# Altium schematic sheet STM32_microcontroller.SchDoc
size A4; SheetNumber: 2; SheetTotal: 7
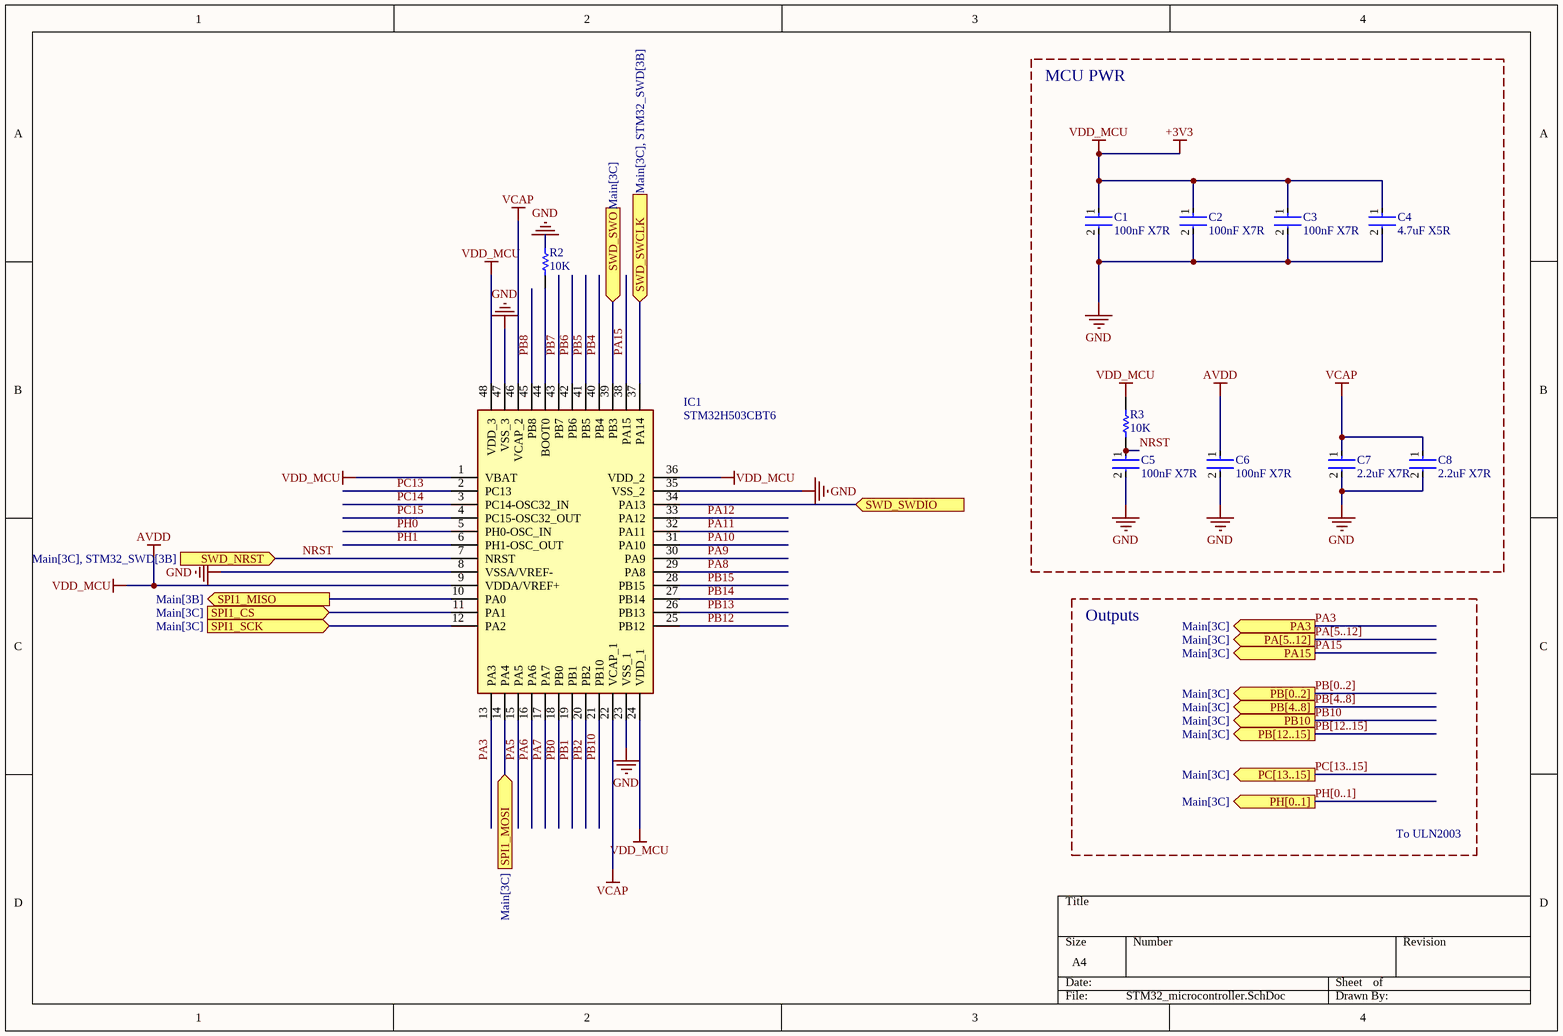
[diagram p0: STM32_microcontroller.SchDoc]

## Parts
C1  100nF X7R  [FP-CL10-IPC_C]
C2  100nF X7R  [FP-CL10-IPC_C]
C3  100nF X7R  [FP-CL10-IPC_C]
C4  4.7uF X5R  [FP-CL21-IPC_B]
C5  100nF X7R  [FP-CL10-IPC_C]
C6  100nF X7R  [FP-CL10-IPC_C]
C7  2.2uF X7R  [FP-CC0805-0_85-MFG]
C8  2.2uF X7R  [FP-CC0805-0_85-MFG]
IC1  STM32H503CBT6  [QFP50P900X900X160-48N]
R2  10K  [RESC1609X50X30ML10T20]
R3  10K  [RESC1609X50X30ML10T20]

## Blocks framed on the sheet
MCU PWR: C1-C8 R3

## Ports
PA3 (out, see Main[3C]), PA15 (out, see Main[3C]), PA[5..12] (out, see Main[3C]), PB10 (out, see Main[3C]), PB[0..2] (out, see Main[3C]), PB[4..8] (out, see Main[3C]), PB[12..15] (out, see Main[3C]), PC[13..15] (out, see Main[3C]), PH[0..1] (out, see Main[3C]), SPI1_CS (in, see Main[3C]), SPI1_MISO (out, see Main[3B]), SPI1_MOSI (in, see Main[3C]), SPI1_SCK (in, see Main[3C]), SWD_NRST (in, see Main[3C], STM32_SWD[3B]), SWD_SWCLK (in, see Main[3C], STM32_SWD[3B]), SWD_SWDIO (in, see Main[3C], STM32_SWD[3B]), SWD_SWO (in, see Main[3C])

## Nets
+3V3: C1.1 C2.1 C3.1 C4.1 C6.1 IC1.1(VBAT) IC1.9(VDDA/VREF+) IC1.24(VDD_1) IC1.36(VDD_2) IC1.48(VDD_3) R3.2  [also labelled AVDD, VDD_MCU]
GND: C1.2 C2.2 C3.2 C4.2 C5.2 C6.2 C7.2 C8.2 IC1.8(VSSA/VREF-) IC1.23(VSS_1) IC1.35(VSS_2) IC1.47(VSS_3) R2.2
VCAP: C7.1 C8.1 IC1.22(VCAP_1) IC1.46(VCAP_2)
NRST: C5.1 IC1.7(NRST) R3.1 ; port SWD_NRST
PA3: IC1.13(PA3) ; port PA3
PA5: IC1.15(PA5)
PA6: IC1.16(PA6)
PA7: IC1.17(PA7)
PA8: IC1.29(PA8)
PA9: IC1.30(PA9)
PA10: IC1.31(PA10)
PA11: IC1.32(PA11)
PA12: IC1.33(PA12)
PA15: IC1.38(PA15) ; port PA15
PB0: IC1.18(PB0)
PB1: IC1.19(PB1)
PB2: IC1.20(PB2)
PB4: IC1.40(PB4)
PB5: IC1.41(PB5)
PB6: IC1.42(PB6)
PB7: IC1.43(PB7)
PB8: IC1.45(PB8)
PB10: IC1.21(PB10) ; port PB10
PB12: IC1.25(PB12)
PB13: IC1.26(PB13)
PB14: IC1.27(PB14)
PB15: IC1.28(PB15)
PC13: IC1.2(PC13)
PC14: IC1.3(PC14-OSC32_IN)
PC15: IC1.4(PC15-OSC32_OUT)
PH0: IC1.5(PH0-OSC_IN)
PH1: IC1.6(PH1-OSC_OUT)
SPI1_CS: IC1.11(PA1) ; port SPI1_CS
SPI1_MISO: IC1.10(PA0) ; port SPI1_MISO
SPI1_MOSI: IC1.14(PA4) ; port SPI1_MOSI
SPI1_SCK: IC1.12(PA2) ; port SPI1_SCK
SWD_SWCLK: IC1.37(PA14) ; port SWD_SWCLK
SWD_SWDIO: IC1.34(PA13) ; port SWD_SWDIO
SWD_SWO: IC1.39(PB3) ; port SWD_SWO
NetIC1_44: IC1.44(BOOT0) R2.1

## Buses and harness runs
bus PA[5..12] = port PA[5..12]
bus PB[0..2] = port PB[0..2]
bus PB[4..8] = port PB[4..8]
bus PB[12..15] = port PB[12..15]
bus PC[13..15] = port PC[13..15]
bus PH[0..1] = port PH[0..1]

## Notes on the sheet
- Outputs
- To ULN2003

## Library data of the parts
C1-C3 C5 C6 = CMP-13271-001423-1: Cap Ceramic 100nF 25V X7R ±10% Pad SMD 0603 +125°C T/R; Depth: 0.8mm; Tolerance: 10%; Case Code (Imperial): 0603; Max Operating Temperature: 125°C; Min Operating Temperature: -55°C; Dielectric: X7R; Width: 0.031inch; Thickness: 0.035inch; Height: 0.8mm; Length: 1.6mm; Mount: Surface Mount; Capacitance: 100nF; Voltage Rating: 25V; Case Code (Metric): 1608; Case/Package: 0603; Radiation Hardening: No; Packaging: Tape and Reel
C4 = CMP-13271-001343-1: CL21 Series 0805 4.7uF 6.3V ±10% Tolerance X5R Multilayer Ceramic Chip Capacitor; Case/Package: 0805; Capacitance: 4.7uF; Length: 2mm; Width: 0.049inch; Thickness: 0.053inch; Package Quantity: 10000; Voltage Rating: 6.3V; Depth: 1.25mm; Radiation Hardening: No; Tolerance: 10%; Dielectric: X5R; Height: 1.25mm; Packaging: Tape and Reel; Min Operating Temperature: -55°C; Max Operating Temperature: 85°C; Mount: Surface Mount
C7 C8 = CMP-03422-000945-1: CAP CER 2.2UF 6.3V X7R 0805; Manufacturer Part Number: CC0805KKX7R5BB225; Manufacturer: Yageo; Tolerance: 0.1; Material: Ceramic; ComponentLink2URL: http://www.yageo.com/documents/recent/UPY-GPHC_Y5V_6.3V-to-50V_8.pdf; Package: CC0805-0.85; Temperature Range Low: -30°C; Temperature: -30°C to +85°C; Footprint Url: http://www.yageo.com/exep/pages/download/literatures/UPY-C_GEN_24.pdf; Category: Cap; Lead Free: Yes; Temperature Range High: +85°C; Octopart: https://octopart.com/cc0805kkx7r5bb225-yageo-29810442; Ipc Land Pattern Name: CAPC200125X85; RoHS: TRUE; Capacitance: 2.2 uF; Height: 0.95mm; Value: 2.2 uF; Device Class L1: Passive Components; Automotive: No; Temperature Characteristic: X7R; Device Class L3: Ceramic Capacitors; Voltage Rating: 6.3 V; ComponentLink2Description: Datasheet; Device Class L2: Capacitors; Mouser Description: Multilayer Ceramic Capacitors MLCC - SMD/SMT 2.2uF 6.3V X7R 10%; Digikey Description: CAP CER 2.2UF 6.3V X7R 0805
IC1 = STM32H503CBT6: Integrated Circuit; Manufacturer_Name: STMicroelectronics; Datasheet Link: https://www.st.com/en/microcontrollers-microprocessors/stm32h503cb.html; Height: 1.6mm; Manufacturer_Part_Number: STM32H503CBT6; Mouser Part Number: 511-STM32H503CBT6; Mouser Price/Stock: https://www.mouser.co.uk/ProductDetail/STMicroelectronics/STM32H503CBT6?qs=amGC7iS6iy99sz%2FXgeIPHg%3D%3D; Arrow Part Number: STM32H503CBT6; Arrow Price/Stock: https://www.arrow.com/en/products/stm32h503cbt6/stmicroelectronics?utm_currency=USD&region=nac
R2 R3 = CMP-2000-03837-1: Manufacturer: Vishay Dale; Part Number: CRCW060310K0FKTB